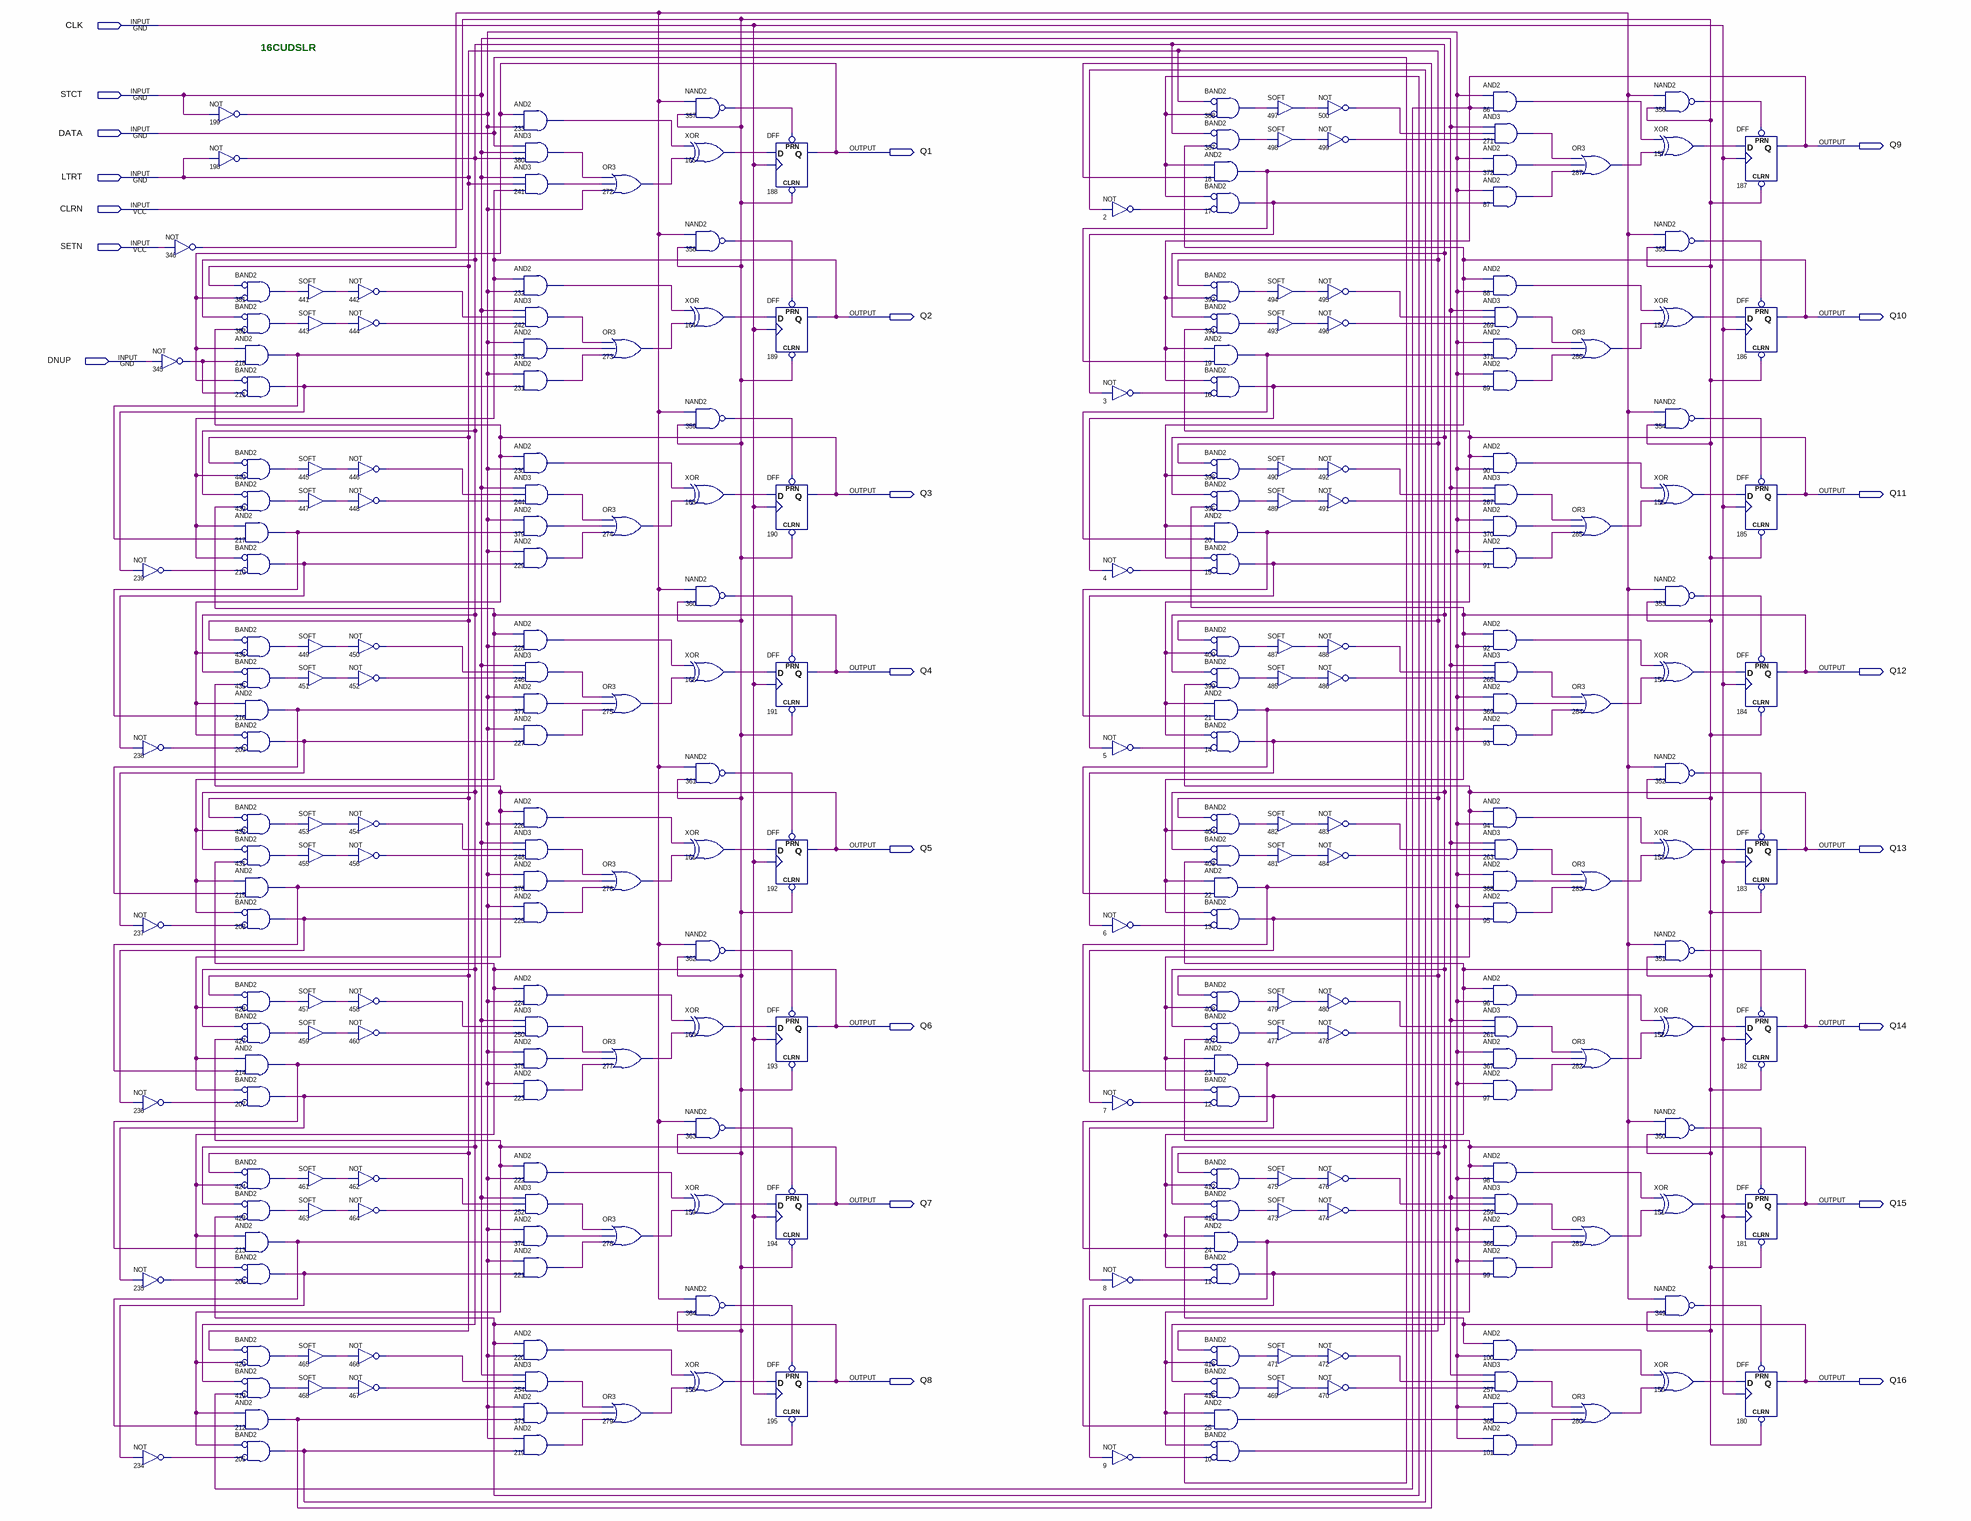
[diagram p0: schematic sheet]
// Quartus schematic 16cudslr.bdf as structural Verilog: 265 symbols, 23 pins
module \16cudslr  (
  input  CLK,
  input  STCT,
  input  DATA,
  input  LTRT,
  input  CLRN,
  input  SETN,
  input  DNUP,
  output Q9,
  output Q1,
  output Q2,
  output Q10,
  output Q3,
  output Q11,
  output Q4,
  output Q12,
  output Q5,
  output Q13,
  output Q6,
  output Q14,
  output Q7,
  output Q15,
  output Q8,
  output Q16
);

  wire n2_out, n3_out, n4_out, n5_out, n6_out, n7_out, n8_out, n9_out, n10_out, n11_out, n12_out, n13_out,
       n14_out, n15_out, n16_out, n17_out, n18_out, n19_out, n20_out, n21_out, n22_out, n23_out, n24_out,
       n25_out, n86_out, n87_out, n88_out, n89_out, n90_out, n91_out, n92_out, n93_out, n94_out, n95_out,
       n96_out, n97_out, n98_out, n99_out, n100_out, n101_out, n150_out, n151_out, n152_out, n153_out,
       n154_out, n155_out, n156_out, n157_out, n158_out, n159_out, n160_out, n161_out, n162_out, n163_out,
       n164_out, n165_out, n198_out, n199_out, n205_out, n206_out, n207_out, n208_out, n209_out, n210_out,
       n211_out, n212_out, n213_out, n214_out, n215_out, n216_out, n217_out, n218_out, n219_out, n220_out,
       n221_out, n222_out, n223_out, n224_out, n225_out, n226_out, n227_out, n228_out, n229_out, n230_out,
       n231_out, n232_out, n233_out, n234_out, n235_out, n236_out, n237_out, n238_out, n239_out, n241_out,
       n242_out, n244_out, n246_out, n248_out, n250_out, n252_out, n254_out, n257_out, n259_out, n261_out,
       n263_out, n265_out, n267_out, n269_out, n271_out, n272_out, n273_out, n274_out, n275_out, n276_out,
       n277_out, n278_out, n279_out, n280_out, n281_out, n282_out, n283_out, n284_out, n285_out, n286_out,
       n287_out, n345_out, n346_out, n349_out, n350_out, n351_out, n352_out, n353_out, n354_out, n355_out,
       n356_out, n357_out, n358_out, n359_out, n360_out, n361_out, n362_out, n363_out, n364_out, n365_out,
       n366_out, n367_out, n368_out, n369_out, n370_out, n371_out, n372_out, n373_out, n374_out, n375_out,
       n376_out, n377_out, n378_out, n379_out, n380_out, n381_out, n382_out, n387_out, n388_out, n391_out,
       n392_out, n395_out, n396_out, n399_out, n400_out, n403_out, n404_out, n407_out, n408_out, n411_out,
       n412_out, n415_out, n416_out, n419_out, n420_out, n423_out, n424_out, n427_out, n428_out, n431_out,
       n432_out, n435_out, n436_out, n439_out, n440_out, n441_out, n442_out, n443_out, n444_out, n445_out,
       n446_out, n447_out, n448_out, n449_out, n450_out, n451_out, n452_out, n453_out, n454_out, n455_out,
       n456_out, n457_out, n458_out, n459_out, n460_out, n461_out, n462_out, n463_out, n464_out, n465_out,
       n466_out, n467_out, n468_out, n469_out, n470_out, n471_out, n472_out, n473_out, n474_out, n475_out,
       n476_out, n477_out, n478_out, n479_out, n480_out, n481_out, n482_out, n483_out, n484_out, n485_out,
       n486_out, n487_out, n488_out, n489_out, n490_out, n491_out, n492_out, n493_out, n494_out, n495_out,
       n496_out, n497_out, n498_out, n499_out, n500_out;

  not u_345 (n345_out, DNUP);
  not u_239 (n239_out, n211_out);
  not u_238 (n238_out, n210_out);
  not u_237 (n237_out, n209_out);
  not u_236 (n236_out, n208_out);
  not u_235 (n235_out, n207_out);
  not u_234 (n234_out, n206_out);
  not u_346 (n346_out, SETN);
  not u_199 (n199_out, STCT);
  not u_198 (n198_out, LTRT);
  and u_381 (n381_out, ~LTRT, ~Q1);  // BAND2
  and u_382 (n382_out, ~n198_out, ~Q3);  // BAND2
  and u_218 (n218_out, Q1, n345_out);
  and u_211 (n211_out, ~Q1, ~n345_out);  // BAND2
  and u_440 (n440_out, ~LTRT, ~Q2);  // BAND2
  and u_439 (n439_out, ~n198_out, ~Q4);  // BAND2
  and u_217 (n217_out, Q2, n218_out);
  and u_210 (n210_out, ~Q2, ~n239_out);  // BAND2
  and u_436 (n436_out, ~LTRT, ~Q3);  // BAND2
  and u_435 (n435_out, ~n198_out, ~Q5);  // BAND2
  and u_216 (n216_out, Q3, n217_out);
  and u_209 (n209_out, ~Q3, ~n238_out);  // BAND2
  and u_432 (n432_out, ~LTRT, ~Q4);  // BAND2
  and u_431 (n431_out, ~n198_out, ~Q6);  // BAND2
  and u_215 (n215_out, Q4, n216_out);
  and u_208 (n208_out, ~Q4, ~n237_out);  // BAND2
  and u_428 (n428_out, ~LTRT, ~Q5);  // BAND2
  and u_427 (n427_out, ~n198_out, ~Q7);  // BAND2
  and u_214 (n214_out, Q5, n215_out);
  and u_207 (n207_out, ~Q5, ~n236_out);  // BAND2
  and u_424 (n424_out, ~LTRT, ~Q6);  // BAND2
  and u_423 (n423_out, ~n198_out, ~Q8);  // BAND2
  and u_213 (n213_out, Q6, n214_out);
  and u_206 (n206_out, ~Q6, ~n235_out);  // BAND2
  and u_420 (n420_out, ~LTRT, ~Q7);  // BAND2
  and u_419 (n419_out, ~n198_out, ~Q9);  // BAND2
  and u_212 (n212_out, Q7, n213_out);
  and u_205 (n205_out, ~Q7, ~n234_out);  // BAND2
  SOFT u_441 (.IN(n381_out), .OUT(n441_out));
  SOFT u_443 (.IN(n382_out), .OUT(n443_out));
  SOFT u_445 (.IN(n440_out), .OUT(n445_out));
  SOFT u_447 (.IN(n439_out), .OUT(n447_out));
  SOFT u_449 (.IN(n436_out), .OUT(n449_out));
  SOFT u_451 (.IN(n435_out), .OUT(n451_out));
  SOFT u_453 (.IN(n432_out), .OUT(n453_out));
  SOFT u_455 (.IN(n431_out), .OUT(n455_out));
  SOFT u_457 (.IN(n428_out), .OUT(n457_out));
  SOFT u_459 (.IN(n427_out), .OUT(n459_out));
  SOFT u_461 (.IN(n424_out), .OUT(n461_out));
  SOFT u_463 (.IN(n423_out), .OUT(n463_out));
  SOFT u_465 (.IN(n420_out), .OUT(n465_out));
  SOFT u_468 (.IN(n419_out), .OUT(n468_out));
  not u_442 (n442_out, n441_out);
  not u_444 (n444_out, n443_out);
  not u_446 (n446_out, n445_out);
  not u_448 (n448_out, n447_out);
  not u_450 (n450_out, n449_out);
  not u_452 (n452_out, n451_out);
  not u_454 (n454_out, n453_out);
  not u_456 (n456_out, n455_out);
  not u_458 (n458_out, n457_out);
  not u_460 (n460_out, n459_out);
  not u_462 (n462_out, n461_out);
  not u_464 (n464_out, n463_out);
  not u_466 (n466_out, n465_out);
  not u_467 (n467_out, n468_out);
  and u_233 (n233_out, Q1, n199_out);
  and u_380 (n380_out, DATA, STCT, n198_out);
  and u_241 (n241_out, STCT, LTRT, Q2);
  and u_232 (n232_out, Q2, n199_out);
  and u_242 (n242_out, STCT, n442_out, n444_out);
  and u_378 (n378_out, n199_out, n218_out);
  and u_231 (n231_out, n199_out, n211_out);
  and u_230 (n230_out, Q3, n199_out);
  and u_244 (n244_out, STCT, n446_out, n448_out);
  and u_379 (n379_out, n199_out, n217_out);
  and u_229 (n229_out, n199_out, n210_out);
  and u_228 (n228_out, Q4, n199_out);
  and u_246 (n246_out, STCT, n450_out, n452_out);
  and u_377 (n377_out, n199_out, n216_out);
  and u_227 (n227_out, n199_out, n209_out);
  and u_226 (n226_out, Q5, n199_out);
  and u_248 (n248_out, STCT, n454_out, n456_out);
  and u_376 (n376_out, n199_out, n215_out);
  and u_225 (n225_out, n199_out, n208_out);
  and u_224 (n224_out, Q6, n199_out);
  and u_250 (n250_out, STCT, n458_out, n460_out);
  and u_375 (n375_out, n199_out, n214_out);
  and u_223 (n223_out, n199_out, n207_out);
  and u_222 (n222_out, Q7, n199_out);
  and u_252 (n252_out, STCT, n462_out, n464_out);
  and u_374 (n374_out, n199_out, n213_out);
  and u_221 (n221_out, n199_out, n206_out);
  and u_220 (n220_out, Q8, n199_out);
  and u_254 (n254_out, STCT, n466_out, n467_out);
  and u_373 (n373_out, n199_out, n212_out);
  and u_219 (n219_out, n199_out, n205_out);
  or u_272 (n272_out, n380_out, n241_out, n199_out);
  or u_273 (n273_out, n242_out, n378_out, n231_out);
  or u_274 (n274_out, n244_out, n379_out, n229_out);
  or u_275 (n275_out, n246_out, n377_out, n227_out);
  or u_276 (n276_out, n248_out, n376_out, n225_out);
  or u_277 (n277_out, n250_out, n375_out, n223_out);
  or u_278 (n278_out, n252_out, n374_out, n221_out);
  or u_279 (n279_out, n254_out, n373_out, n219_out);
  nand u_357 (n357_out, n346_out, CLRN);
  xor u_165 (n165_out, n233_out, n272_out);
  nand u_358 (n358_out, n346_out, CLRN);
  xor u_164 (n164_out, n232_out, n273_out);
  nand u_359 (n359_out, n346_out, CLRN);
  xor u_163 (n163_out, n230_out, n274_out);
  nand u_360 (n360_out, n346_out, CLRN);
  xor u_162 (n162_out, n228_out, n275_out);
  nand u_361 (n361_out, n346_out, CLRN);
  xor u_161 (n161_out, n226_out, n276_out);
  nand u_362 (n362_out, n346_out, CLRN);
  xor u_160 (n160_out, n224_out, n277_out);
  nand u_363 (n363_out, n346_out, CLRN);
  xor u_159 (n159_out, n222_out, n278_out);
  nand u_364 (n364_out, n346_out, CLRN);
  xor u_158 (n158_out, n220_out, n279_out);
  DFF u_188 (.CLRN(CLRN), .CLK(CLK), .D(n165_out), .PRN(n357_out), .Q(Q1));
  DFF u_189 (.CLRN(CLRN), .CLK(CLK), .D(n164_out), .PRN(n358_out), .Q(Q2));
  DFF u_190 (.CLRN(CLRN), .CLK(CLK), .D(n163_out), .PRN(n359_out), .Q(Q3));
  DFF u_191 (.CLRN(CLRN), .CLK(CLK), .D(n162_out), .PRN(n360_out), .Q(Q4));
  DFF u_192 (.CLRN(CLRN), .CLK(CLK), .D(n161_out), .PRN(n361_out), .Q(Q5));
  DFF u_193 (.CLRN(CLRN), .CLK(CLK), .D(n160_out), .PRN(n362_out), .Q(Q6));
  DFF u_194 (.CLRN(CLRN), .CLK(CLK), .D(n159_out), .PRN(n363_out), .Q(Q7));
  DFF u_195 (.CLRN(CLRN), .CLK(CLK), .D(n158_out), .PRN(n364_out), .Q(Q8));
  not u_2 (n2_out, n205_out);
  not u_3 (n3_out, n17_out);
  not u_4 (n4_out, n16_out);
  not u_5 (n5_out, n15_out);
  not u_6 (n6_out, n14_out);
  not u_7 (n7_out, n13_out);
  not u_8 (n8_out, n12_out);
  not u_9 (n9_out, n11_out);
  and u_388 (n388_out, ~LTRT, ~Q8);  // BAND2
  and u_387 (n387_out, ~n198_out, ~Q10);  // BAND2
  and u_18 (n18_out, Q8, n212_out);
  and u_17 (n17_out, ~Q8, ~n2_out);  // BAND2
  and u_392 (n392_out, ~LTRT, ~Q9);  // BAND2
  and u_391 (n391_out, ~n198_out, ~Q11);  // BAND2
  and u_19 (n19_out, Q9, n18_out);
  and u_16 (n16_out, ~Q9, ~n3_out);  // BAND2
  and u_396 (n396_out, ~LTRT, ~Q10);  // BAND2
  and u_395 (n395_out, ~n198_out, ~Q12);  // BAND2
  and u_20 (n20_out, Q10, n19_out);
  and u_15 (n15_out, ~Q10, ~n4_out);  // BAND2
  and u_400 (n400_out, ~LTRT, ~Q11);  // BAND2
  and u_399 (n399_out, ~n198_out, ~Q13);  // BAND2
  and u_21 (n21_out, Q11, n20_out);
  and u_14 (n14_out, ~Q11, ~n5_out);  // BAND2
  and u_404 (n404_out, ~LTRT, ~Q12);  // BAND2
  and u_403 (n403_out, ~n198_out, ~Q14);  // BAND2
  and u_22 (n22_out, Q12, n21_out);
  and u_13 (n13_out, ~Q12, ~n6_out);  // BAND2
  and u_408 (n408_out, ~LTRT, ~Q13);  // BAND2
  and u_407 (n407_out, ~n198_out, ~Q15);  // BAND2
  and u_23 (n23_out, Q13, n22_out);
  and u_12 (n12_out, ~Q13, ~n7_out);  // BAND2
  and u_412 (n412_out, ~LTRT, ~Q14);  // BAND2
  and u_411 (n411_out, ~n198_out, ~Q16);  // BAND2
  and u_24 (n24_out, Q14, n23_out);
  and u_11 (n11_out, ~Q14, ~n8_out);  // BAND2
  and u_416 (n416_out, ~LTRT, ~Q15);  // BAND2
  and u_415 (n415_out, ~n198_out, ~DATA);  // BAND2
  and u_25 (n25_out, Q15, n24_out);
  and u_10 (n10_out, ~Q15, ~n9_out);  // BAND2
  SOFT u_497 (.IN(n388_out), .OUT(n497_out));
  SOFT u_498 (.IN(n387_out), .OUT(n498_out));
  SOFT u_494 (.IN(n392_out), .OUT(n494_out));
  SOFT u_493 (.IN(n391_out), .OUT(n493_out));
  SOFT u_490 (.IN(n396_out), .OUT(n490_out));
  SOFT u_489 (.IN(n395_out), .OUT(n489_out));
  SOFT u_487 (.IN(n400_out), .OUT(n487_out));
  SOFT u_485 (.IN(n399_out), .OUT(n485_out));
  SOFT u_482 (.IN(n404_out), .OUT(n482_out));
  SOFT u_481 (.IN(n403_out), .OUT(n481_out));
  SOFT u_479 (.IN(n408_out), .OUT(n479_out));
  SOFT u_477 (.IN(n407_out), .OUT(n477_out));
  SOFT u_475 (.IN(n412_out), .OUT(n475_out));
  SOFT u_473 (.IN(n411_out), .OUT(n473_out));
  SOFT u_471 (.IN(n416_out), .OUT(n471_out));
  SOFT u_469 (.IN(n415_out), .OUT(n469_out));
  not u_500 (n500_out, n497_out);
  not u_499 (n499_out, n498_out);
  not u_495 (n495_out, n494_out);
  not u_496 (n496_out, n493_out);
  not u_492 (n492_out, n490_out);
  not u_491 (n491_out, n489_out);
  not u_488 (n488_out, n487_out);
  not u_486 (n486_out, n485_out);
  not u_483 (n483_out, n482_out);
  not u_484 (n484_out, n481_out);
  not u_480 (n480_out, n479_out);
  not u_478 (n478_out, n477_out);
  not u_476 (n476_out, n475_out);
  not u_474 (n474_out, n473_out);
  not u_472 (n472_out, n471_out);
  not u_470 (n470_out, n469_out);
  and u_86 (n86_out, n199_out, Q9);
  and u_271 (n271_out, STCT, n500_out, n499_out);
  and u_372 (n372_out, n199_out, n18_out);
  and u_87 (n87_out, n199_out, n17_out);
  and u_88 (n88_out, Q10, n199_out);
  and u_269 (n269_out, STCT, n495_out, n496_out);
  and u_371 (n371_out, n199_out, n19_out);
  and u_89 (n89_out, n199_out, n16_out);
  and u_90 (n90_out, Q11, n199_out);
  and u_267 (n267_out, STCT, n492_out, n491_out);
  and u_370 (n370_out, n199_out, n20_out);
  and u_91 (n91_out, n199_out, n15_out);
  and u_92 (n92_out, Q12, n199_out);
  and u_265 (n265_out, STCT, n488_out, n486_out);
  and u_369 (n369_out, n199_out, n21_out);
  and u_93 (n93_out, n199_out, n14_out);
  and u_94 (n94_out, Q13, n199_out);
  and u_263 (n263_out, STCT, n483_out, n484_out);
  and u_368 (n368_out, n199_out, n22_out);
  and u_95 (n95_out, n199_out, n13_out);
  and u_96 (n96_out, Q14, n199_out);
  and u_261 (n261_out, STCT, n480_out, n478_out);
  and u_367 (n367_out, n199_out, n23_out);
  and u_97 (n97_out, n199_out, n12_out);
  and u_98 (n98_out, Q15, n199_out);
  and u_259 (n259_out, STCT, n476_out, n474_out);
  and u_366 (n366_out, n199_out, n24_out);
  and u_99 (n99_out, n199_out, n11_out);
  and u_100 (n100_out, Q16, n199_out);
  and u_257 (n257_out, STCT, n472_out, n470_out);
  and u_365 (n365_out, n199_out, n25_out);
  and u_101 (n101_out, n199_out, n10_out);
  or u_287 (n287_out, n271_out, n372_out, n87_out);
  or u_286 (n286_out, n269_out, n371_out, n89_out);
  or u_285 (n285_out, n267_out, n370_out, n91_out);
  or u_284 (n284_out, n265_out, n369_out, n93_out);
  or u_283 (n283_out, n263_out, n368_out, n95_out);
  or u_282 (n282_out, n261_out, n367_out, n97_out);
  or u_281 (n281_out, n259_out, n366_out, n99_out);
  or u_280 (n280_out, n257_out, n365_out, n101_out);
  nand u_356 (n356_out, n346_out, CLRN);
  xor u_157 (n157_out, n86_out, n287_out);
  nand u_355 (n355_out, n346_out, CLRN);
  xor u_156 (n156_out, n88_out, n286_out);
  nand u_354 (n354_out, n346_out, CLRN);
  xor u_155 (n155_out, n90_out, n285_out);
  nand u_353 (n353_out, n346_out, CLRN);
  xor u_154 (n154_out, n92_out, n284_out);
  nand u_352 (n352_out, n346_out, CLRN);
  xor u_153 (n153_out, n94_out, n283_out);
  nand u_351 (n351_out, n346_out, CLRN);
  xor u_152 (n152_out, n96_out, n282_out);
  nand u_350 (n350_out, n346_out, CLRN);
  xor u_151 (n151_out, n98_out, n281_out);
  nand u_349 (n349_out, n346_out, CLRN);
  xor u_150 (n150_out, n100_out, n280_out);
  DFF u_187 (.CLRN(CLRN), .CLK(CLK), .D(n157_out), .PRN(n356_out), .Q(Q9));
  DFF u_186 (.CLRN(CLRN), .CLK(CLK), .D(n156_out), .PRN(n355_out), .Q(Q10));
  DFF u_185 (.CLRN(CLRN), .CLK(CLK), .D(n155_out), .PRN(n354_out), .Q(Q11));
  DFF u_184 (.CLRN(CLRN), .CLK(CLK), .D(n154_out), .PRN(n353_out), .Q(Q12));
  DFF u_183 (.CLRN(CLRN), .CLK(CLK), .D(n153_out), .PRN(n352_out), .Q(Q13));
  DFF u_182 (.CLRN(CLRN), .CLK(CLK), .D(n152_out), .PRN(n351_out), .Q(Q14));
  DFF u_181 (.CLRN(CLRN), .CLK(CLK), .D(n151_out), .PRN(n350_out), .Q(Q15));
  DFF u_180 (.CLRN(CLRN), .CLK(CLK), .D(n150_out), .PRN(n349_out), .Q(Q16));

  // Notes on the sheet:
  //   16CUDSLR
endmodule
